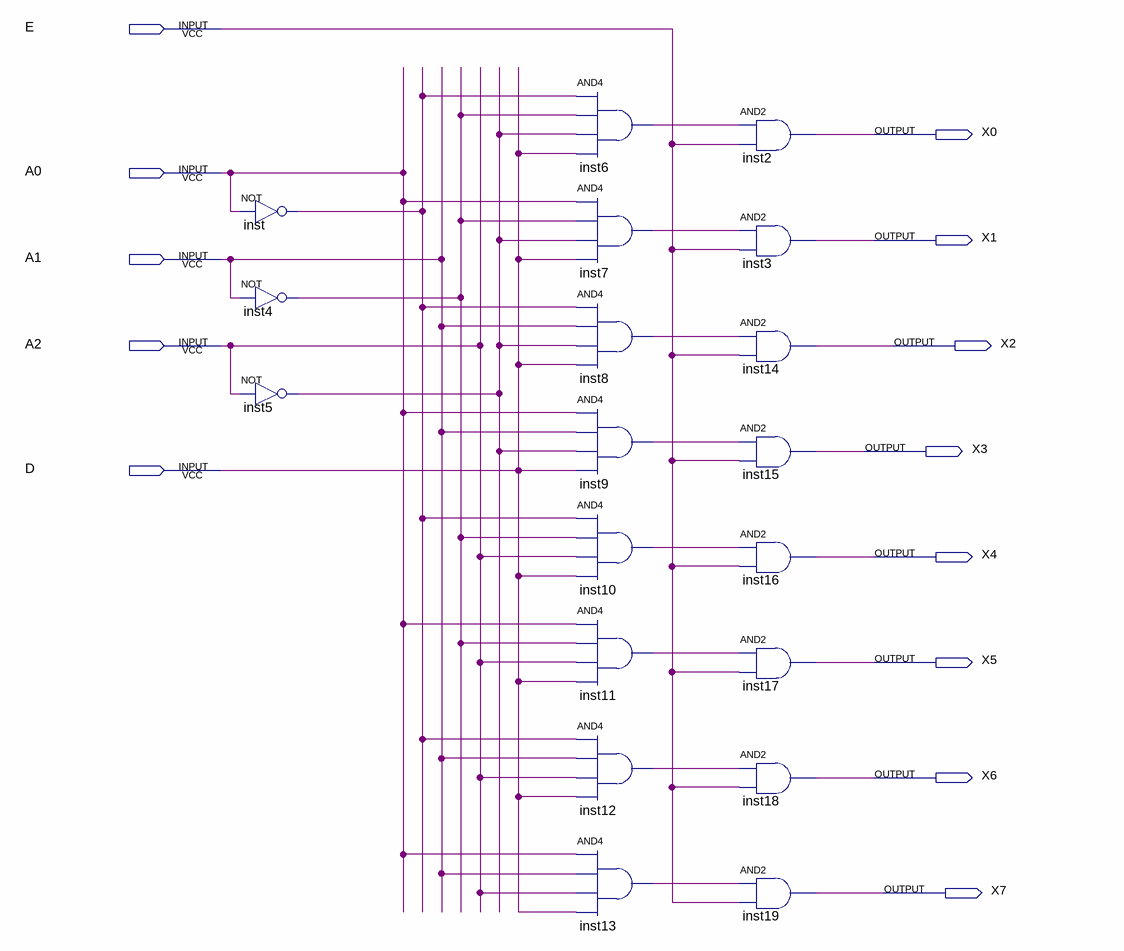
[diagram p0: schematic sheet]
// Quartus schematic lab1.bdf as structural Verilog: 19 symbols, 13 pins
module lab1 (
  input  E,
  input  A0,
  input  A1,
  input  A2,
  input  D,
  output X0,
  output X1,
  output X2,
  output X3,
  output X4,
  output X5,
  output X6,
  output X7
);

  wire inst4_out, inst5_out, inst6_out, inst7_out, inst8_out, inst9_out, inst10_out, inst11_out, inst12_out,
       inst13_out, inst_out;

  not inst (inst_out, A0);
  not inst4 (inst4_out, A1);
  not inst5 (inst5_out, A2);
  and inst6 (inst6_out, inst_out, inst4_out, inst5_out, D);
  and inst7 (inst7_out, A0, inst4_out, inst5_out, D);
  and inst8 (inst8_out, inst_out, A1, inst5_out, D);
  and inst9 (inst9_out, A0, A1, inst5_out, D);
  and inst10 (inst10_out, inst_out, inst4_out, A2, D);
  and inst11 (inst11_out, A0, inst4_out, A2, D);
  and inst12 (inst12_out, inst_out, A1, A2, D);
  and inst13 (inst13_out, A0, A1, A2, D);
  and inst2 (X0, inst6_out, E);
  and inst3 (X1, inst7_out, E);
  and inst14 (X2, inst8_out, E);
  and inst15 (X3, inst9_out, E);
  and inst16 (X4, inst10_out, E);
  and inst17 (X5, inst11_out, E);
  and inst18 (X6, inst12_out, E);
  and inst19 (X7, inst13_out, E);
endmodule
